# EAGLE design alimentadorV7 (EAGLE 6.6.0)
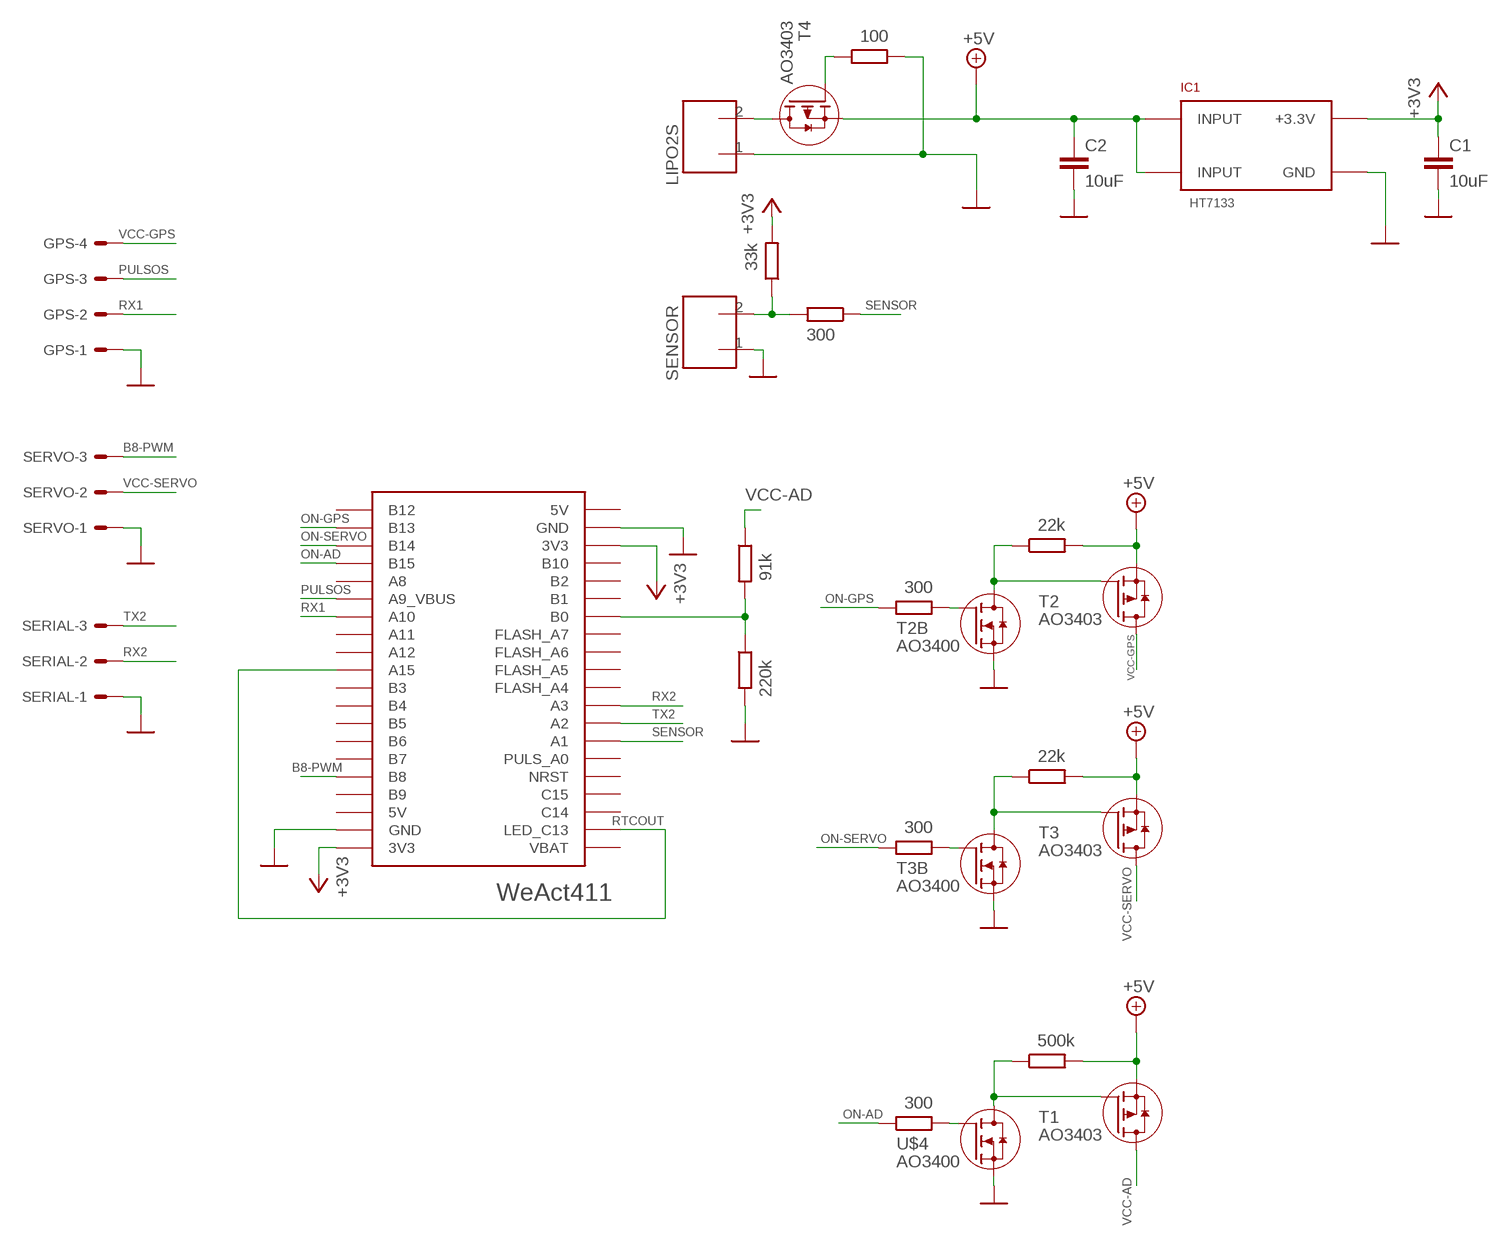
[diagram p0: schematic, sheet 1]

## Parts
C1  10uF  C-EUC1206  [C1206]
C2  10uF  C-EUC1206  [C1206]
GPS  22-23-2041  [22-23-2041]
IC1  HT7133  [SOT89]
LIPO2S  CONECTOR_2P-3.81  [CON2P-3.81]
R1  22k  R-EU_R1206  [R1206]
R2  220k  R-EU_R1206  [R1206]
R3  91k  R-EU_R1206  [R1206]
R4  300  R-EU_R1206  [R1206]
R5  22k  R-EU_R1206  [R1206]
R6  300  R-EU_R1206  [R1206]
R7  100  R-EU_R1206  [R1206]
R9  33k  R-EU_R1206  [R1206]
R10  300  R-EU_R1206  [R1206]
R11  500k  R-EU_R1206  [R1206]
SENSOR  CONECTOR_2P-3.81  [CON2P-3.81]
SERIAL  22-23-2031  [22-23-2031]
SERVO  22-23-2031  [22-23-2031]
T1  AO3403  [SOT23]
T1B  300  R-EU_R1206  [R1206]
T2  AO3403  [SOT23]
T2B  AO3400  [SOT23]
T3  AO3403  [SOT23]
T3B  AO3400  [SOT23]
T4  AO3403  [SOT23]
U$2  WEACT411  [WEACT411]
U$4  AO3400  [SOT23]

## Nets
+3V3: C1.1 IC1.3(+3.3V) R9.2 U$2.3V3@1(3V3) U$2.3V3@2(3V3)
+5V: C2.1 IC1.2(INPUT) IC1.4(INPUT) R1.2 R5.2 R11.2 T1.2(S) T2.2(S) T3.2(S) T4.2(S)
B8-PWM: SERVO.3 U$2.B8
GND [pwr]: C1.2 C2.2 GPS.1 IC1.1(GND) LIPO2S.1 R2.2 R7.2 SENSOR.1 SERIAL.1 SERVO.1 T2B.2(S) T3B.2(S) U$2.GND@1(GND) U$2.GND@2(GND) U$4.2(S)
N$1: LIPO2S.2 T4.3(D)
N$2: R2.1 R3.2 U$2.B0
N$3: R7.1 T4.1(G)
N$4: U$2.A15 U$2.C13(LED_C13)
N$5: R1.1 T2.1(G) T2B.3(D)
N$6: R11.1 T1.1(G) U$4.3(D)
N$7: R4.2 T2B.1(G)
N$8: R5.1 T3.1(G) T3B.3(D)
N$9: R9.1 R10.2 SENSOR.2
N$10: R6.2 T3B.1(G)
N$11: T1B.2 U$4.1(G)
ON-AD: T1B.1 U$2.B15
ON-GPS: R4.1 U$2.B13
ON-SERVO: R6.1 U$2.B14
PULSOS: GPS.3 U$2.A9(A9_VBUS)
RX1: GPS.2 U$2.A10
RX2: SERIAL.2 U$2.A3
SENSOR: R10.1 U$2.A1
TX2: SERIAL.3 U$2.A2
VCC-AD: R3.1 T1.3(D)
VCC-GPS: GPS.4 T2.3(D)
VCC-SERVO: SERVO.2 T3.3(D)
Unconnected: U$2.5V@1(5V) U$2.5V@2(5V) U$2.A0(PULS_A0) U$2.A4(FLASH_A4) U$2.A5(FLASH_A5) U$2.A6(FLASH_A6) U$2.A7(FLASH_A7) U$2.A8 U$2.A11 U$2.A12 U$2.B1 U$2.B2 U$2.B3 U$2.B4 U$2.B5 U$2.B6 U$2.B7 U$2.B9 U$2.B10 U$2.B12 U$2.C14 U$2.C15 U$2.NRST U$2.VBAT

## Notes on the sheet
- RTCOUT

## Library data of the parts
C1 C2 = rcl:C-EU: CAPACITOR, European symbol
GPS = con-molex:22-23-2041: .100" (2.54mm) Center Header - 4 Pin; MF: MOLEX; MPN: 22-23-2041; OC_FARNELL: 1462920; OC_NEWARK: 38C0355
IC1 = jcf:HT7133: HT73333 Regulador LDO 3.3V Vinput max. 12V Iquiescent 4uA Imax 250mA
LIPO2S SENSOR = jcf:CONECTOR_2P-3.81
R1-R7 R9-R11 T1B = rcl:R-EU_: RESISTOR, European symbol
SERIAL SERVO = con-molex:22-23-2031: .100" (2.54mm) Center Header - 3 Pin; MF: MOLEX; MPN: 22-23-2031; OC_FARNELL: 1462950; OC_NEWARK: 30C0862
T1-T4 = jcf:AO3403: AO3403 P-channel MOSFET 2.6A 30V
T2B T3B U$4 = jcf:AO3400: A3400 MOSFET-N 30V 5.8A 52mohm@Vgs2.5
U$2 = jcf:WEACT411: WeAct STM32F411

## Net classes
0 default: width 0.241 mm, drill 0.584 mm, clearance 0.241 mm
1 pwr: width 0.25 mm

## Board
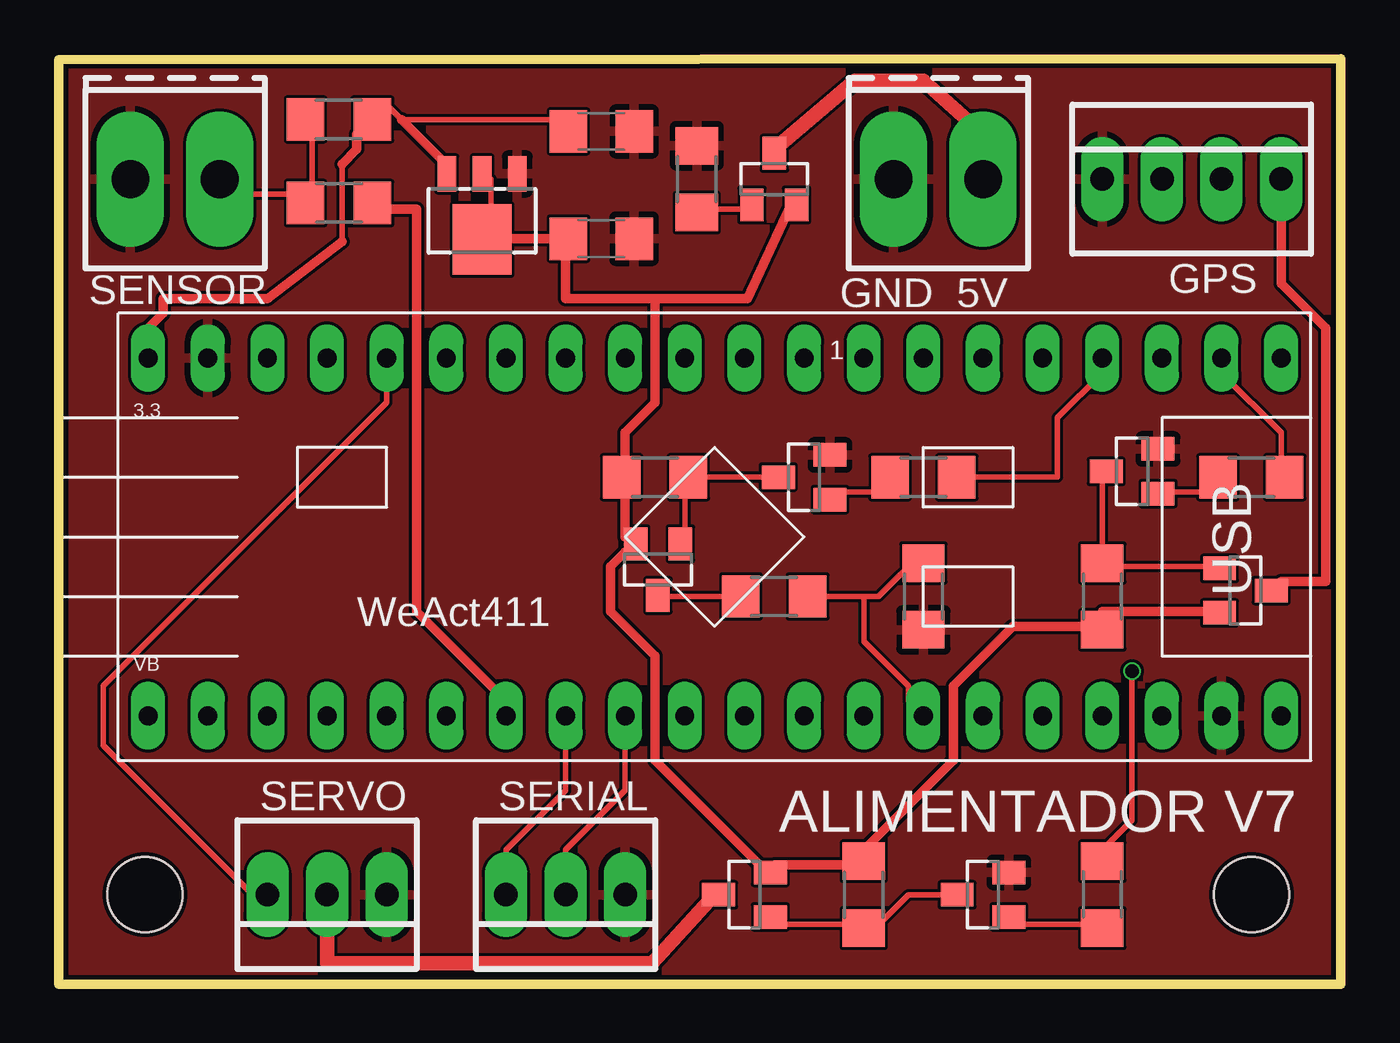
[diagram p1: board, top side]
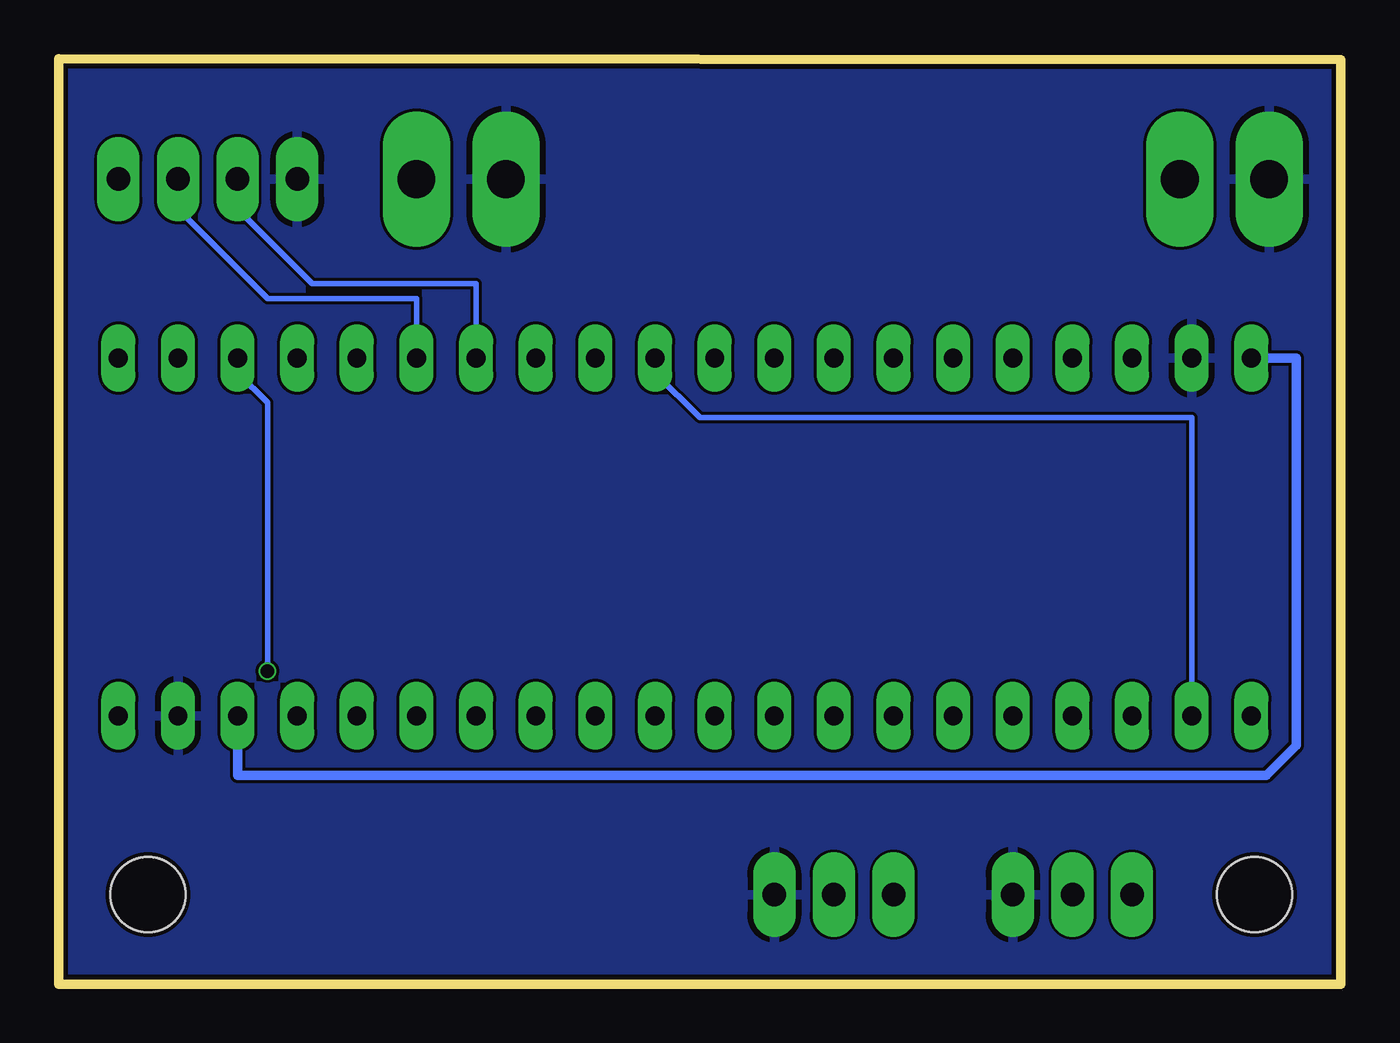
[diagram p2: board, bottom side, seen from below]

Size 54.61 x 39.42 mm. Coordinates in mm from the lower left corner, seen from the top.
Outline: 0,39.37 0,0 54.61,0 54.61,39.42 0,39.37
Copper layers (1*16): Top 0.035mm / dielectric 1.6mm / Bottom 0.035mm
Design rules "jlcpcb-2layers": minimum track width 5mil, minimum drill 0.3mm, track to track 5mil, track to pad 5mil, pad to pad 5mil, via to via 5mil, smd to smd 5mil, copper to edge 0.2mm, drill to drill 6mil, minimum pad ring 10mil, minimum via ring 3mil, stop-mask expansion 4mil, vias tented up to drill 0mil, thermal gap 10mil
Holes 3.2 mm at 50.8,3.81 3.68,3.81

### Footprints (pad centres in the part's own frame; a part is rotated, then mirrored left to right if it is on the bottom)
C1206 = smd 1.6 x 1.8: 1 -1.4,0; 2 1.4,0
22-23-2041 = drill 1 long: 1 -3.81,0; 2 -1.27,0; 3 1.27,0; 4 3.81,0
SOT89 = smd 0.8 x 1.5: 1 -1.5,-1.75; 2 0,-1.75; 3 1.5,-1.75 | smd 2.5 x 3: 4 0,1.05
CON2P-3.81 = drill 1.6 long: 1 0,0; 2 3.81,0
R1206 = smd 1.6 x 1.803: 1 -1.422,0; 2 1.422,0
22-23-2031 = drill 1 long: 1 -2.54,0; 2 0,0; 3 2.54,0
SOT23 = smd 1 x 1.4: 1 -0.95,-1.1; 2 0.95,-1.1; 3 0,1.1
WEACT411 = drill 0.8 long: 3V3@1 43.18,0; 3V3@2 0,15.24; 5V@1 48.26,0; 5V@2 5.08,15.24; A0 12.7,0; A1 15.24,0; A2 17.78,0; A3 20.32,0; A4 22.86,0; A5 25.4,0; A6 27.94,0; A7 30.48,0; A8 38.1,15.24; A9 35.56,15.24; A10 33.02,15.24; A11 30.48,15.24; A12 27.94,15.24; A15 25.4,15.24; B0 33.02,0; B1 35.56,0; B2 38.1,0; B3 22.86,15.24; B4 20.32,15.24; B5 17.78,15.24; B6 15.24,15.24; B7 12.7,15.24; B8 10.16,15.24; B9 7.62,15.24; B10 40.64,0; B12 48.26,15.24; B13 45.72,15.24; B14 43.18,15.24; B15 40.64,15.24; C13 2.54,0; C14 5.08,0; C15 7.62,0; GND@1 45.72,0; GND@2 2.54,15.24; NRST 10.16,0; VBAT 0,0

### Placement (x,y rotation side)
C1  23.11,36.32 0 top
C2  23.11,31.75 0 top
GPS  48.26,34.29 0 top
IC1  18.03,32.77 180 top
LIPO2S  35.56,34.29 0 top
R1  44.45,16.51 270 top
R2  36.83,16.51 270 top
R3  30.48,16.51 0 top
R4  50.8,21.59 180 top
R5  34.29,3.81 90 top
R6  44.45,3.81 270 top
R7  27.18,34.29 90 top
R9  11.94,36.83 0 top
R10  11.94,33.27 180 top
R11  25.4,21.59 180 top
SENSOR  3.05,34.29 0 top
SERIAL  21.59,3.81 180 top
SERVO  11.43,3.81 180 top
T1  25.53,17.65 180 top
T1B  36.83,21.59 180 top
T2  50.55,16.76 270 top
T2B  45.72,21.84 90 top
T3  29.21,3.81 90 top
T3B  39.37,3.81 90 top
T4  30.48,34.29 0 top
U$2  3.81,11.43 0 top
U$4  31.75,21.59 90 top

### Tracks (layer width: path | path; a pad name or v marks a point on that pad's centre or on a via)
+3V3
  Top 0.241: 13.33,36.83 13.33,37.46 13.97,37.46 14.61,36.83 21.59,36.83 C1.1 | 16.51,34.92 IC1.3 | 12.7,36.2 13.33,36.83 | 12.06,31.62 12.06,34.92 | 13.33,36.83 R9.2
  Top 0.406: 14.61,36.83 16.51,34.92 | 12.7,36.2 12.7,35.56 12.06,34.92 | 12.06,31.62 8.89,29.21 4.45,29.21 4.45,28.57 3.81,27.94 U$2.3V3@2
  Bottom 0.406: U$2.3V3@1 46.99,8.89 3.17,8.89 1.91,10.16 1.91,26.67 U$2.3V3@2
+5V
  Top 0.241: 30.48,5.08 T3.2 29.84,5.08 | 34.29,5.08 R5.2 34.29,5.71 | 44.45,15.87 44.45,15.24 R1.2 | 48.9,15.87 T2.2 | IC1.2 18.41,34.29 18.41,31.75 IC1.4 | 31.11,33.02 T4.2 | 24.13,21.59 R11.2 | 21.59,31.75 C2.1 | 24.13,18.42 T1.2
  Top 0.406: 34.29,5.08 30.48,5.08 | 44.45,15.87 48.9,15.87 | 34.29,5.71 38.1,9.53 38.1,12.7 40.64,15.24 44.45,15.24 | T1.2 24.13,19.05 24.13,21.59 24.13,23.5 25.4,24.77 25.4,29.21 | 31.11,33.02 29.34,29.21 25.4,29.21 | 25.4,29.21 21.59,29.21 21.59,31.75 18.41,31.75 | 29.84,5.08 25.4,9.53 25.4,13.97 23.5,15.87 23.5,17.78 24.13,18.42
B8-PWM
  Top 0.241: U$2.B8 13.97,24.77 1.91,12.7 1.91,10.16 8.26,3.81 SERVO.3
GND
  pour Bottom: 0,0 54.61,0 54.61,39.37 0,39.37
  pour Top: 0,39.37 54.61,39.37 54.61,0 0,0
N$1
  Top 0.241: 30.48,35.56 T4.3
  Top 0.61: 30.48,35.56 33.91,38.48 36.83,38.48 39.37,36.2 LIPO2S.2
N$2
  Top 0.241: 34.29,16.51 34.93,16.51 36.83,18.42 R2.1 | 34.29,16.51 R3.2 | U$2.B0 36.2,12.06 36.2,12.7 34.29,14.6 34.29,16.51
N$3
  Top 0.241: T4.1 29.21,33.02 27.3,33.02 R7.1
N$4
  Bottom 0.241: U$2.C13 6.35,24.13 27.3,24.13 29.21,26.04 U$2.A15
N$5
  Top 0.241: T2.1 48.9,17.78 44.45,17.78 R1.1 44.45,21.59 T2B.3
N$6
  Top 0.241: T1.1 26.67,19.05 26.67,21.59 R11.1 U$4.3
N$7
  Top 0.241: T2B.1 46.99,20.96 48.9,20.96 48.9,21.59 R4.2
N$8
  Top 0.241: T3.1 30.48,2.54 34.29,2.54 R5.1 34.29,1.9 36.2,3.81 T3B.3
N$9
  Top 0.241: R9.1 10.79,36.83 10.79,33.66 R10.2 10.16,33.66 6.98,33.66 6.98,34.29 SENSOR.2
N$10
  Top 0.241: T3B.1 40.64,2.54 44.45,2.54 R6.2
N$11
  Top 0.241: U$4.1 33.02,20.96 34.93,20.96 34.93,21.59 T1B.2
ON-AD
  Top 0.241: T1B.1 42.55,21.59 42.55,24.13 44.45,26.04 U$2.B15
ON-GPS
  Top 0.241: U$2.B13 49.53,26.04 52.07,23.5 52.07,21.59 R4.1
ON-SERVO  (via drill 0.58)
  Top 0.241: v45.72,13.33 45.72,6.98 44.45,5.71 R6.1
  Bottom 0.241: v45.72,13.33 45.72,24.77 46.99,26.04 U$2.B14
PULSOS
  Bottom 0.241: U$2.A9 39.37,29.21 45.72,29.21 49.53,33.02 GPS.3
RX1
  Bottom 0.241: U$2.A10 36.83,29.85 43.82,29.85 46.99,33.02 GPS.2
RX2
  Top 0.241: U$2.A3 24.13,8.25 21.59,5.71 SERIAL.2
SENSOR
  Top 0.241: 13.97,33.02 R10.1
  Top 0.406: 13.97,33.02 15.24,33.02 15.24,15.87 19.05,12.06 U$2.A1
TX2
  Top 0.241: U$2.A2 21.59,8.25 19.05,5.71 SERIAL.3
VCC-AD
  Top 0.241: R3.1 25.4,16.51 T1.3
VCC-GPS
  Top 0.241: 52.07,17.14 T2.3
  Top 0.406: 52.07,17.14 53.98,17.14 53.98,27.94 52.07,29.85 GPS.4
VCC-SERVO
  Top 0.241: 27.94,3.81 T3.3
  Top 0.61: 27.94,3.81 25.27,0.89 11.43,0.89 SERVO.2

### Text on the board
tPlace: GND 5V
tNames: 1 | ALIMENTADOR V7
tDocu: Gnd | Gnd | Gnd